# Altium schematic sheet 2layer_COB.SchDoc
size A; SheetNumber: 1; SheetTotal: 1
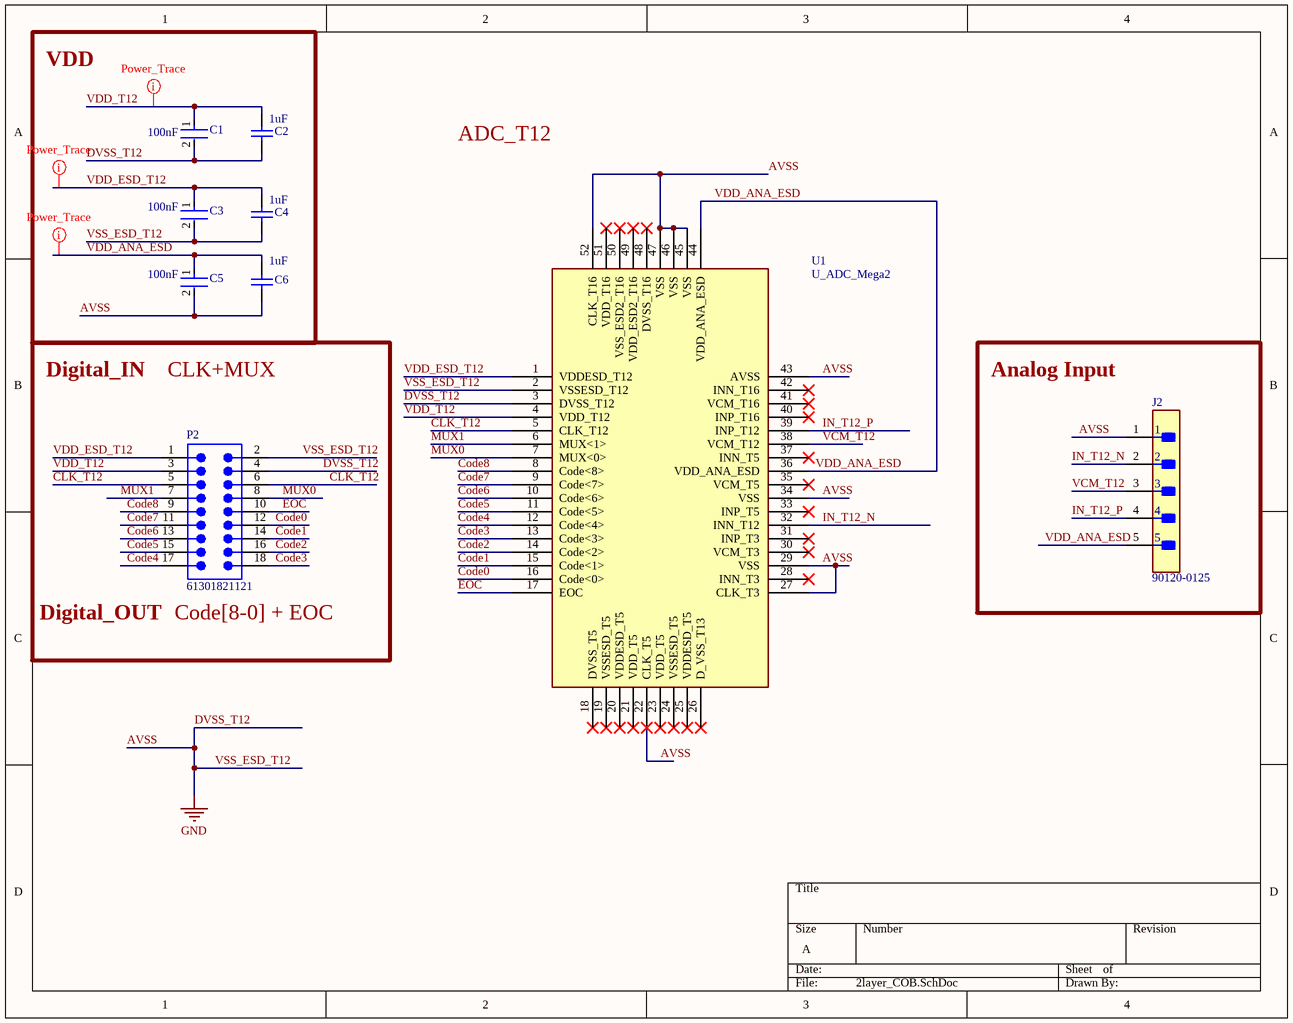
[diagram p0: 2layer_COB.SchDoc]

## Parts
C1  Capacitance: 100nF  [FP-0805-L_2_01_0_2-W_1_25-IPC_C]  (hidden comment: 08055C104KAT4A)
C2  value 1uF  [CAPC2013X140X50NL20T25]  (hidden comment: 08055D105KAT2A)
C3  Capacitance: 100nF  [FP-0805-L_2_01_0_2-W_1_25-IPC_C]  (hidden comment: 08055C104KAT4A)
C4  value 1uF  [CAPC2013X140X50NL20T25]  (hidden comment: 08055D105KAT2A)
C5  Capacitance: 100nF  [FP-0805-L_2_01_0_2-W_1_25-IPC_C]  (hidden comment: 08055C104KAT4A)
C6  value 1uF  [CAPC2013X140X50NL20T25]  (hidden comment: 08055D105KAT2A)
J2  90120-0125  [FP-90120-0125-MFG]
P2  61301821121  [61301821121]
U1  U_ADC_Mega2  [ADC_Team12]

## Blocks framed on the sheet
VDD: C1-C6
Analog Input: J2

## Nets
AVSS: C1.2 C2.1 C3.2 C4.1 C5.2 C6.1 J2.1 P2.2 P2.4 U1.2(VSSESD_T12) U1.3(DVSS_T12) U1.22(CLK_T5) U1.27(CLK_T3) U1.29(VSS) U1.34(VSS) U1.43(AVSS) U1.45(VSS) U1.46(VSS) U1.47(VSS) U1.52(CLK_T16)  [also labelled DVSS_T12, GND, VSS_ESD_T12]
CLK_T12: P2.5 P2.6 U1.5(CLK_T12)
Code0: P2.12 U1.16(Code<0>)
Code1: P2.14 U1.15(Code<1>)
Code2: P2.16 U1.14(Code<2>)
Code3: P2.18 U1.13(Code<3>)
Code4: P2.17 U1.12(Code<4>)
Code5: P2.15 U1.11(Code<5>)
Code6: P2.13 U1.10(Code<6>)
Code7: P2.11 U1.9(Code<7>)
Code8: P2.9 U1.8(Code<8>)
EOC: P2.10 U1.17(EOC)
IN_T12_N: J2.2 U1.32(INN_T12)
IN_T12_P: J2.4 U1.39(INP_T12)
MUX0: P2.8 U1.7(MUX<0>)
MUX1: P2.7 U1.6(MUX<1>)
VCM_T12: J2.3 U1.38(VCM_T12)
VDD_ANA_ESD: C5.1 C6.2 J2.5 U1.36(VDD_ANA_ESD) U1.44(VDD_ANA_ESD)
VDD_ESD_T12: C3.1 C4.2 P2.1 U1.1(VDDESD_T12)
VDD_T12: C1.1 C2.2 P2.3 U1.4(VDD_T12)

Not connected (* = marked no-connect by the designer): U1 18(DVSS_T5)* 19(VSSESD_T5)* 20(VDDESD_T5)* 21(VDD_T5)* 23(VDD_T5)* 24(VSSESD_T5)* 25(VDDESD_T5)* 26(D_VSS_T13)* 28(INN_T3)* 30(VCM_T3)* 31(INP_T3)* 33(INP_T5)* 35(VCM_T5)* 37(INN_T5)* 40(INP_T16)* 41(VCM_T16)* 42(INN_T16)* 48(DVSS_T16)* 49(VDD_ESD2_T16)* 50(VSS_ESD2_T16)* 51(VDD_T16)*

## Layout directives
rule Width Constraint [Pref Width = 20mil    Min Width = 10mil    Max Width = 100mil]: VDD_ANA_ESD, VDD_ESD_T12, VDD_T12

## Notes on the sheet
- ADC_T12
- Digital_IN
- CLK+MUX
- (near P2) Digital_OUT
- (near P2) Code[8-0] + EOC

## Library data of the parts
C1 C3 C5 = CMP-1036-04419-3: CAP CER 0.1UF 50V X7R 0805; Dissipation Factor: 2.5%; Dielectric Material: Ceramic; Tolerance: 10%; Package Quantity: 15000; Case/Package: 0805; REACH SVHC: No SVHC; Voltage: 50V; Min Operating Temperature: -55°C; Radiation Hardening: No; Case Code (Imperial): 0805; Construction: Flat; Lead Free: Lead Free; Termination: SMD/SMT; Mount: Surface Mount; Length: 2.01mm; Height: 0.94mm; Packaging: Tape and Reel; Case Code (Metric): 2012; Dielectric: X7R; Number of Pins: 2; Max Operating Temperature: 125°C; Voltage Rating: 50V; Depth: 1.25mm; Width: 1.25mm; Voltage Rating (DC): 50V; RoHS Compliant: Yes
C2 C4 C6 = CMP-1036-04762-2: Manufacturer: AVX Interconnect / Elco; Part Number: 08055D105KAT2A
J2 = CMP-00257-00655425-1: 90120-0125 2.54mm Pitch C-Grid III Header, Single Row, Vertical, 5 Circuits, Tin (Sn) Plating; NexarPartId: 655425; Manufacturer Lifecycle Status: ACTIVE; Lead Length: 2.9mm; Number of Positions: 5; Current Rating: 3A; Mating Post Length: 6.75mm; Glow Wire Compliant: Non-compliant; Contact Resistance: 20mΩ; Voltage Rating: 350V; Gender: Male; Max Voltage Rating (DC): 350.35kV; Max Operating Temperature: 125°C; Number of Pins: 5; Plating: Tin; Contact Material: Brass; Mount: Through Hole; Contact Gender: Male; Packaging: Bulk; Schedule B: 8536694040; Lifecycle Status: Production; Lead Pitch: 2.54mm; Radiation Hardening: No; Orientation: Vertical; Min Operating Temperature: -55°C; Country of Origin: SK; Housing Color: Black; REACH SVHC: No SVHC; Contact Plating: Tin; Number of Rows: 1; Number of Circuits: 5; Termination: Solder; Number of Contacts: 5; Pitch: 2.54mm; Housing Material: Polyester; RoHS: Compliant; Lead Free: Lead Free; Voltage Rating (AC): 350V
P2 = CMP-1502-01101-3: NexarPartId: 32855553; Pitch: 2.54mm; Number of Positions: 18; Contact Resistance: 20mΩ; Connector Type: Male Pin; Operating Supply Voltage: 250V; Gender: Male; Current Rating: 3A; Packaging: Bulk; Termination: Solder; Lead Pitch: 2.54mm; Number of Pins: 18; REACH SVHC: Unknown; Contact Mating Length: 5.9944mm; Orientation: Vertical; Number of Rows: 2; Contact Material: Copper; Mount: Through Hole; Row Spacing: 2.54mm; Color: Black; RoHS: Compliant; Number of Contacts: 18; Contact Plating: Gold
U1 = U_ADC_Mega2: MegaGroup2